# EAGLE design ESP-01 Breakout adapter 2015-11-22 (EAGLE 7.4.0)
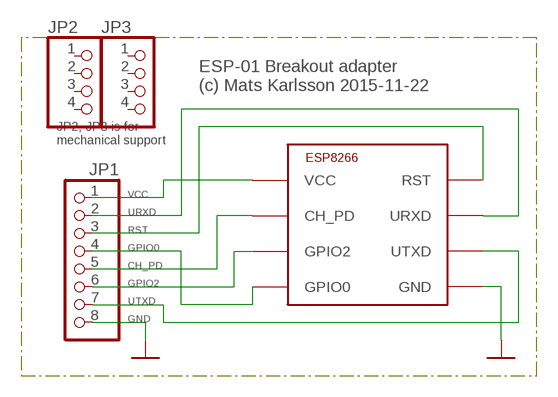
[diagram p0: schematic, sheet 1]

## Parts
ESP8266  ESP8266-01  [ESP-01]
JP1  PINHD-1X8  [1X08]
JP2  PINHD-1X4  [1X04]
JP3  PINHD-1X4  [1X04]

## Nets
CH_PD: ESP8266.P$2(CH_PD) JP1.5
GND: ESP8266.P$8(GND) JP1.8
GPIO0: ESP8266.P$6(GPIO0) JP1.4
GPIO2: ESP8266.P$7(GPIO2) JP1.6
RST: ESP8266.P$3(RST) JP1.3
URXD: ESP8266.P$5(URXD) JP1.2
UTXD: ESP8266.P$1(UTXD) JP1.7
VCC: ESP8266.P$4(VCC) JP1.1
Unconnected: JP2.1 JP2.2 JP2.3 JP2.4 JP3.1 JP3.2 JP3.3 JP3.4

## Notes on the sheet
- ESP-01 Breakout adapter
  (c) Mats Karlsson 2015-11-22
- JP2, JP3 is for
  mechanical support

## Library data of the parts
ESP8266 = #ESP8266:ESP8266-01: ESP8266 - ESP-01 Module
JP1 = pinhead:PINHD-1X8: PIN HEADER
JP2 JP3 = pinhead:PINHD-1X4: PIN HEADER

## Board
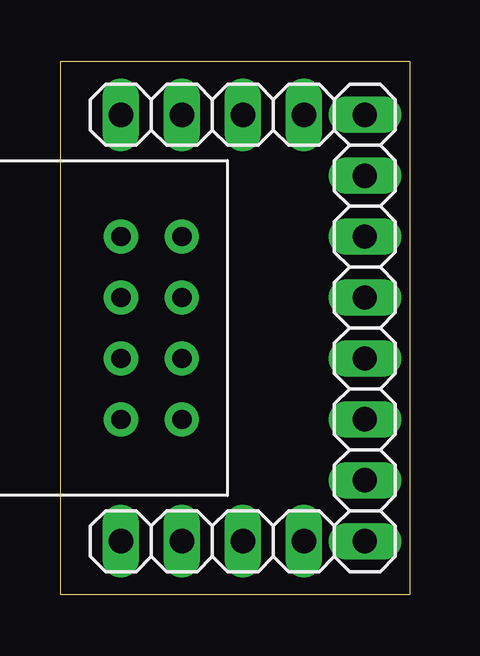
[diagram p1: board, top side]
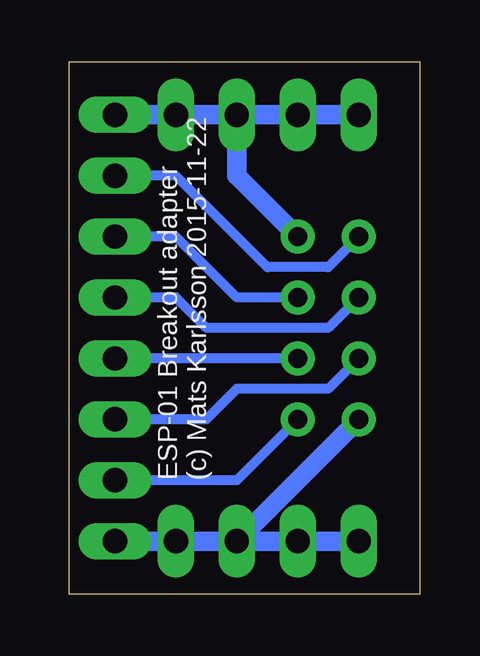
[diagram p2: board, bottom side, seen from below]

Size 14.59 x 22.21 mm. Coordinates in mm from the lower left corner, seen from the top.
Outline: 0,0 14.59,0 14.59,22.21 0,22.21 0,0
Copper layers (1*16): Top 0.035mm / dielectric 1.5mm / Bottom 0.035mm
Design rules "default": minimum track width 10mil, minimum drill 24mil, track to track 8mil, track to pad 8mil, pad to pad 8mil, via to via 8mil, smd to smd 8mil, copper to edge 40mil, drill to drill 8mil, minimum pad ring 10mil, minimum via ring 8mil, stop-mask expansion 4mil, vias tented up to drill 0mil, thermal gap 10mil

### Footprints (pad centres in the part's own frame; a part is rotated, then mirrored left to right if it is on the bottom)
ESP-01 = drill 0.8 pad 1.422: P$1 0,0; P$2 2.54,0; P$3 5.08,0; P$4 7.62,0; P$5 7.62,2.54; P$6 5.08,2.54; P$7 2.54,2.54; P$8 0,2.54
1X08 = drill 1.016 long: 1 -8.89,0; 2 -6.35,0; 3 -3.81,0; 4 -1.27,0; 5 1.27,0; 6 3.81,0; 7 6.35,0; 8 8.89,0
1X04 = drill 1.016 long: 1 -3.81,0; 2 -1.27,0; 3 1.27,0; 4 3.81,0

### Placement (x,y rotation side)
ESP8266  5.08,7.3 90 top
JP1  12.7,11.11 270 top
JP2  6.35,20 0 top
JP3  6.35,2.22 0 top

### Tracks (layer width: path | path; a pad name or v marks a point on that pad's centre or on a via)
CH_PD
  Bottom 0.406: ESP8266.P$2 JP1.5
GND
  Bottom 0.813: ESP8266.P$8 7.62,2.22 | 2.54,2.22 7.62,2.22 | 7.62,2.22 JP1.8
GPIO0
  Bottom 0.406: ESP8266.P$6 3.81,11.11 8.89,11.11 10.16,12.38 JP1.4
GPIO2
  Bottom 0.406: ESP8266.P$7 3.81,8.57 7.62,8.57 8.89,7.3 JP1.6
RST
  Bottom 0.406: ESP8266.P$3 7.62,12.38 10.16,14.92 JP1.3
URXD
  Bottom 0.406: ESP8266.P$5 3.81,13.65 6.35,13.65 10.16,17.46 JP1.2
UTXD
  Bottom 0.406: ESP8266.P$1 7.62,4.76 JP1.7
VCC
  Bottom 0.813: ESP8266.P$4 7.62,17.46 7.62,20 | 2.54,20 7.62,20 | 7.62,20 JP1.1

### Text on the board
bNames: ESP-01 Breakout adapter / (c) Mats Karlsson 2015-11-22
tValues: VCC | URXD | RST | GPIO0 | CH_PD | GPIO2 | UTXD | GND